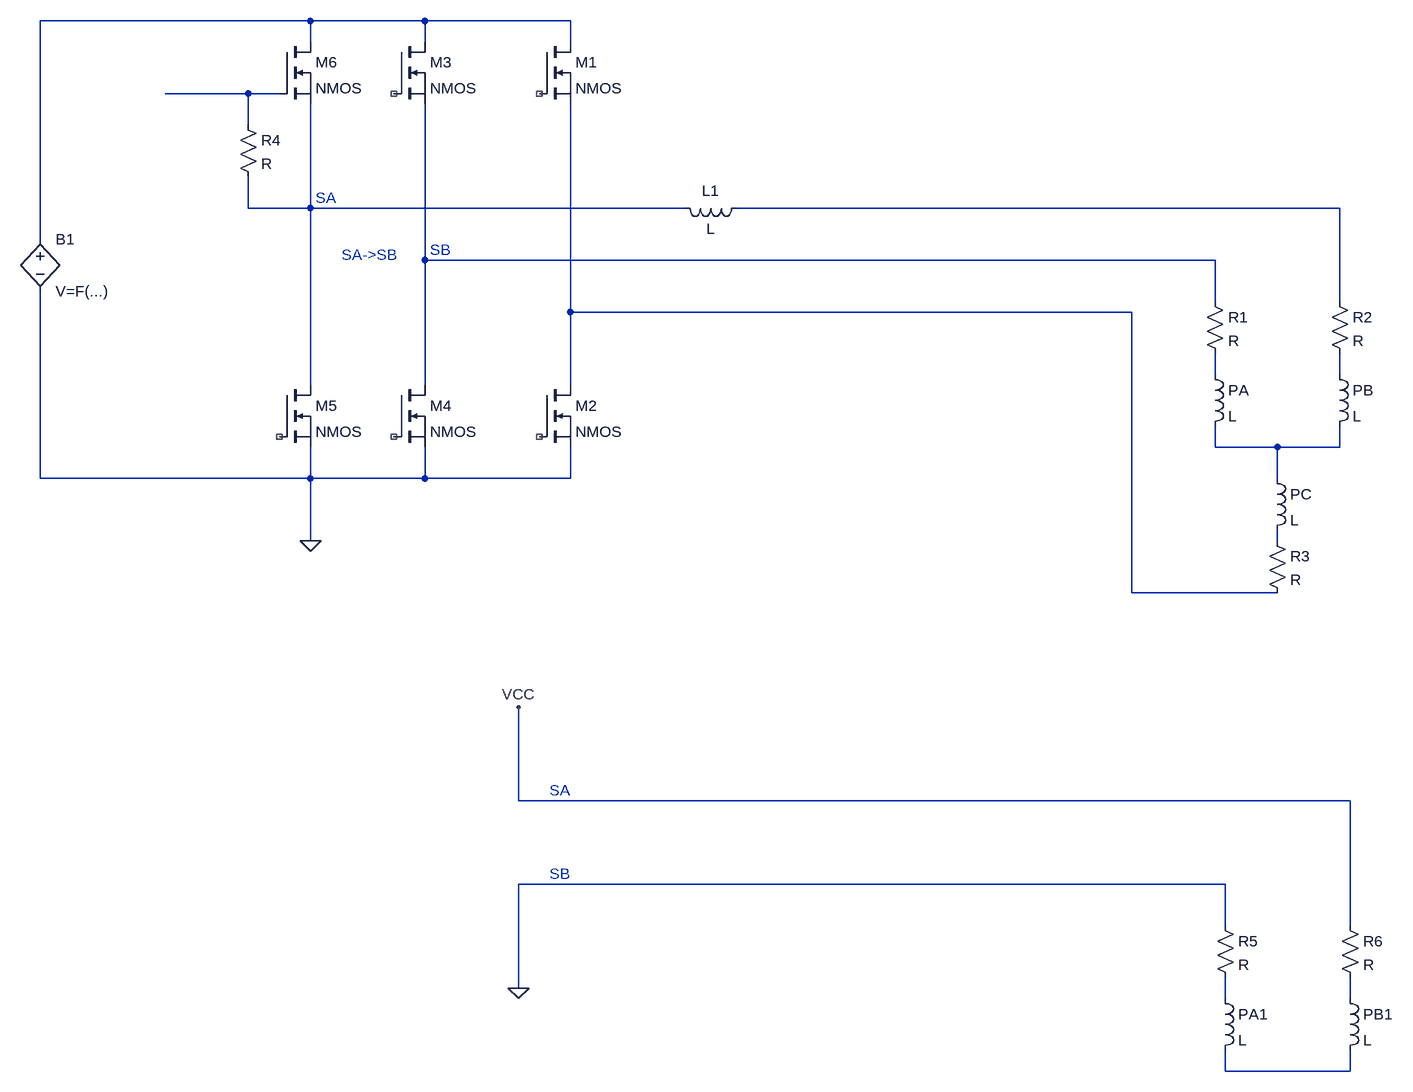
[diagram p0: schematic Draft1.asc]
Draft1.asc, the LTspice schematic file:
Version 4
SHEET 1 880 1076
WIRE -848 -544 -1264 -544
WIRE -672 -544 -848 -544
WIRE -448 -544 -672 -544
WIRE -848 -512 -848 -544
WIRE -672 -512 -672 -544
WIRE -448 -512 -448 -544
WIRE -944 -432 -1072 -432
WIRE -896 -432 -944 -432
WIRE -944 -384 -944 -432
WIRE -944 -256 -944 -304
WIRE -848 -256 -848 -416
WIRE -848 -256 -944 -256
WIRE -272 -256 -848 -256
WIRE 736 -256 -192 -256
WIRE -1264 -208 -1264 -544
WIRE -672 -176 -672 -416
WIRE 544 -176 -672 -176
WIRE 544 -112 544 -176
WIRE 736 -112 736 -256
WIRE -448 -96 -448 -416
WIRE 416 -96 -448 -96
WIRE 544 0 544 -32
WIRE 736 0 736 -32
WIRE -848 16 -848 -256
WIRE -672 16 -672 -176
WIRE -448 16 -448 -96
WIRE 544 112 544 80
WIRE 640 112 544 112
WIRE 736 112 736 80
WIRE 736 112 640 112
WIRE -1264 160 -1264 -128
WIRE -848 160 -848 112
WIRE -848 160 -1264 160
WIRE -672 160 -672 112
WIRE -672 160 -848 160
WIRE -448 160 -448 112
WIRE -448 160 -672 160
WIRE 640 160 640 112
WIRE -848 256 -848 160
WIRE 640 256 640 240
WIRE 416 336 416 -96
WIRE 640 336 416 336
WIRE -528 656 -528 512
WIRE 752 656 -528 656
WIRE 560 784 -528 784
WIRE 560 848 560 784
WIRE 752 848 752 656
WIRE -528 944 -528 784
WIRE 560 960 560 928
WIRE 752 960 752 928
WIRE 560 1072 560 1040
WIRE 752 1072 752 1040
WIRE 752 1072 560 1072
FLAG -848 256 0
FLAG -528 944 0
FLAG -528 512 VCC
SYMBOL ind 528 -16 R0
SYMATTR InstName PA
SYMBOL ind 720 -16 R0
SYMATTR InstName PB
SYMBOL ind 624 144 R0
SYMATTR InstName PC
SYMBOL res 528 -128 R0
SYMATTR InstName R1
SYMBOL res 720 -128 R0
SYMATTR InstName R2
SYMBOL res 624 240 R0
SYMATTR InstName R3
SYMBOL nmos -496 -512 R0
SYMATTR InstName M1
SYMBOL nmos -496 16 R0
SYMATTR InstName M2
SYMBOL nmos -720 -512 R0
SYMATTR InstName M3
SYMBOL nmos -720 16 R0
SYMATTR InstName M4
SYMBOL nmos -896 16 R0
SYMATTR InstName M5
SYMBOL nmos -896 -512 R0
SYMATTR InstName M6
SYMBOL bv -1264 -224 R0
SYMATTR InstName B1
SYMBOL res -960 -400 R0
SYMATTR InstName R4
SYMBOL ind -176 -272 R90
WINDOW 0 5 56 VBottom 2
WINDOW 3 32 56 VTop 2
SYMATTR InstName L1
SYMBOL ind 544 944 R0
SYMATTR InstName PA1
SYMBOL ind 736 944 R0
SYMATTR InstName PB1
SYMBOL res 544 832 R0
SYMATTR InstName R5
SYMBOL res 736 832 R0
SYMATTR InstName R6
TEXT -840 -272 Left 2 ;SA
TEXT -664 -192 Left 2 ;SB
TEXT -800 -184 Left 2 ;SA->SB
TEXT -480 640 Left 2 ;SA
TEXT -480 768 Left 2 ;SB

The netlist it stands for:
* Draft1.asc
L§PA N007 N009 L
L§PB N008 N009 L
L§PC N009 N010 L
R1 N005 N007 R
R2 N004 N008 R
R3 N010 N006 R
M1 N001 NC_01 N006 N006 NMOS
M2 N006 NC_02 0 0 NMOS
M3 N001 NC_03 N005 N005 NMOS
M4 N005 NC_04 0 0 NMOS
M5 N003 NC_05 0 0 NMOS
M6 N001 N002 N003 N003 NMOS
B1 N001 0 V=F(...)
R4 N002 N003 R
L1 N004 N003 L
L§PA1 N011 N013 L
L§PB1 N012 N013 L
R5 0 N011 R
R6 VCC N012 R
.model NMOS NMOS
.model PMOS PMOS
.lib standard.mos
* SA
* SB
* SA->SB
* SA
* SB
.backanno
.end